# Altium schematic sheet DVD.SchDoc (part 2 of 3)
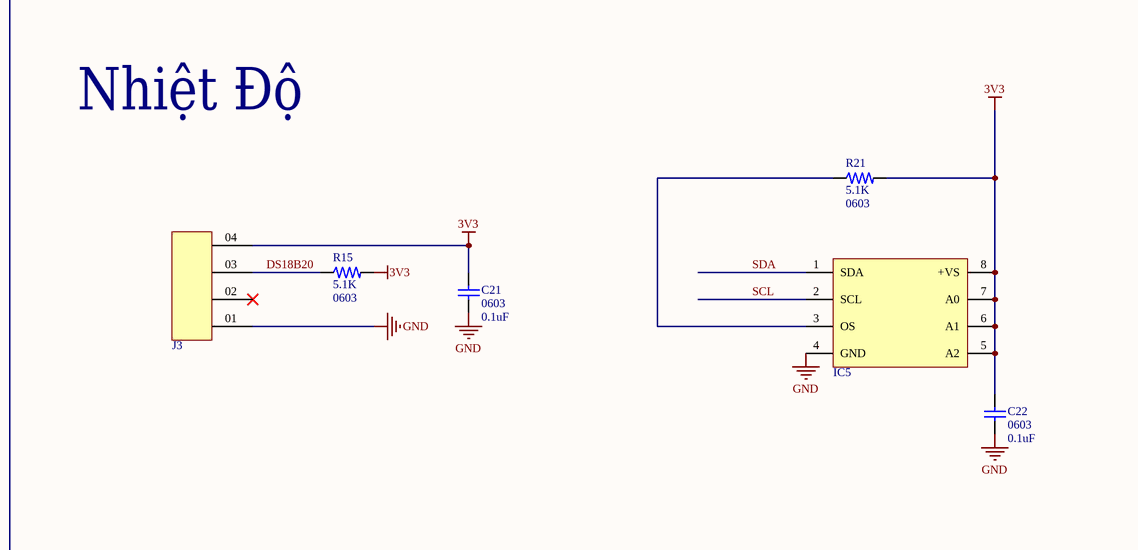
[diagram p6: DVD.SchDoc, bottom right]
## Library data of the parts
C1 = CAP; 22uF; 25V; SMD; CC0603MRX5R6BB226: Multilayer Ceramic Capacitor, 22 uF, 10 V, ï¿½ 20%, X5R, 0603 [1608 Metric]; Manufacturer: Yageo; Designer: TVBac; Supplier: Future Electronics; Supplier Part Number: 9078094; Manufacturer Part Number: CC0603MRX5R6BB226; RoHS: No; Category: Ceramic Capacitors; Stock: 780000; Pricing: 4000=0.122, 8000=0.12, 12000=0.119, 16000=0.118 (USD); Lead Free: 5697LeadFree; Halogen Free: 5694HalogenFree; ComponentLink1URL: http://www.mouser.com/ds/2/447/Yageo_UPY-GP_NP0_16V-to-50V_9-358835.pdf?src-supplier=Mouser; ComponentLink1Description: http://www.mouser.com/ds/2/447/Yageo_UPY-GP_NP0_16V-to-50V_9-358835.pdf?src-supplier=Mouser; ComponentLink2URL: http://www.yageo.com/documents/recent/UPY-GPHC_X5R_4V-to-50V_25.pdf?src-supplier=Digikey; ComponentLink2Description: http://www.yageo.com/documents/recent/UPY-GPHC_X5R_4V-to-50V_25.pdf?src-supplier=Digikey; ComponentLink3URL: https://datasheet.octopart.com/CC0603MRX5R6BB226-Yageo-datasheet-137875056.pdf?src-supplier=Future+Electronics; ComponentLink3Description: https://datasheet.octopart.com/CC0603MRX5R6BB226-Yageo-datasheet-137875056.pdf?src-supplier=Future+Electronics; ComponentLink4URL: https://www.digikey.com/en/products/detail/yageo/CC0603MRX5R6BB226/5195226; ComponentLink4Description: Link Digikey; RoHS Compliant: 5897YesNo
C2 C12 C15 = CAP; 10uF; 25V; SMD; 0603; CC0603MRX5R8BB106: Multilayer Ceramic Capacitor, 10 uF, 25 V, ï¿½ 20%, X5R, 0603 [1608 Metric]; Manufacturer: Yageo; Designer: TVBac; Supplier: Future Electronics; Supplier Part Number: 3086968; Manufacturer Part Number: CC0603MRX5R8BB106; RoHS: Yes; Category: Ceramic Capacitors; Stock: 296000; Pricing: 4000=0.155, 8000=0.153, 12000=0.151 (USD); Mounting Technology: Surface Mount; Case/Package: 0603; Case Code (Imperial): 0603; Case Code (Metric): 1608; Min Operating Temperature: -55°C; Max Operating Temperature: 85°C; Packaging: Cut Tape; Tolerance: 20%; Voltage Rating: 25V; Series: CC; Dielectric: X5R; Voltage Rating (DC): 25V; RoHS Compliant: Yes; Halogen Free: Halogen Free; Lead Free: Lead Free; ComponentLink1URL: https://www.yageo.com/upload/media/product/productsearch/datasheet/mlcc/UPY-GPHC_X5R_4V-to-50V_26.pdf?src-supplier=Digikey; ComponentLink1Description: https://www.yageo.com/upload/media/product/productsearch/datasheet/mlcc/UPY-GPHC_X5R_4V-to-50V_26.pdf?src-supplier=Digikey; ComponentLink2URL: https://datasheet.octopart.com/CC0603MRX5R8BB106-Yageo-datasheet-182965619.pdf?src-supplier=Farnell; ComponentLink2Description: https://datasheet.octopart.com/CC0603MRX5R8BB106-Yageo-datasheet-182965619.pdf?src-supplier=Farnell; ComponentLink3Description: Link Digikey; ComponentLink3URL: https://www.digikey.com/en/products/detail/yageo/CC0603MRX5R8BB106/7164378
C3 = CAP; 1uF; 16V; 0603; SMD; CC0603KRX7R7BB105: 0603 1 uF 16 V ±10 % Tolerance X7R SMT Multilayer Ceramic Capacitor; Manufacturer: Yageo; Material: 4241ConductorMaterial; Dissipation Factor: 5%; Designer: TVBac; Supplier: Digikey; Supplier Part Number: 311-1446-1-ND; Manufacturer Part Number: CC0603KRX7R7BB105; RoHS: Yes; Category: Ceramic Capacitors; Stock: 9165861; Pricing: 1=0.1, 10=0.066, 50=0.0392, 100=0.0308, 500=0.02274, 1000=0.01882, 4000=0.01785, 8000=0.01626, 12000=0.01545, 20000=0.01456, 28000=0.01404, 40000=0.01353, 100000=0.01313 (USD); Dielectric: X7R; Voltage Rating (DC): 16V; Lead Free: 5697LeadFree; Halogen Free: 5694HalogenFree; ComponentLink1URL: https://datasheet.ciiva.com/8033/1734573-8033801.pdf?src-supplier=Element14; ComponentLink1Description: https://datasheet.ciiva.com/8033/1734573-8033801.pdf?src-supplier=Element14; ComponentLink2URL: https://datasheet.ciiva.com/8033/1734573-8033800.pdf?src-supplier=Element14; ComponentLink2Description: https://datasheet.ciiva.com/8033/1734573-8033800.pdf?src-supplier=Element14; ComponentLink3URL: https://datasheet.ciiva.com/7978/1489800-7978143.pdf?src-supplier=Element14; ComponentLink3Description: https://datasheet.ciiva.com/7978/1489800-7978143.pdf?src-supplier=Element14; ComponentLink4URL: https://datasheet.ciiva.com/28450/1489800-28450557.pdf?src-supplier=Element14; ComponentLink4Description: https://datasheet.ciiva.com/28450/1489800-28450557.pdf?src-supplier=Element14; ComponentLink5Description: https://datasheet.ciiva.com/176/mlccorderingcode-176789.pdf?src-supplier=Digikey; ComponentLink5URL: https://datasheet.ciiva.com/176/mlccorderingcode-176789.pdf?src-supplier=Digikey; ComponentLink6Description: https://datasheet.ciiva.com/176/mlccorderingcode-176788.pdf?src-supplier=Digikey; ComponentLink6URL: https://datasheet.ciiva.com/176/mlccorderingcode-176788.pdf?src-supplier=Digikey; ComponentLink7Description: https://datasheet.ciiva.com/176/mlccorderingcode-176790.pdf?src-supplier=Digikey; ComponentLink7URL: https://datasheet.ciiva.com/176/mlccorderingcode-176790.pdf?src-supplier=Digikey; Mounting Technology: Surface Mount; Case/Package: 0603; Pins: 2; Case Code (Metric): 1608; Case Code (Imperial): 0603; Min Operating Temperature: -55°C; Max Operating Temperature: 125°C; Tolerance: 10%; Voltage Rating: 16V; Package Quantity: 1; Packaging: Tape and Reel; Termination: SMD/SMT; Voltage: 16V; Series: CC; Construction: Flat; Length: 1.6mm; Width: 0.031inch; Height: 0.8mm; Thickness: 0.035inch; Depth: 0.8mm; Radiation Hardening: No; RoHS Compliant: Yes; Reach SVHC Compliant: Unknown; ComponentLink8URL: https://datasheet.ciiva.com/5425/upy-gphc-x7r-6-3v-to-50v-8-12304-5425495.pdf?src-supplier=Mouser; ComponentLink8Description: https://datasheet.ciiva.com/5425/upy-gphc-x7r-6-3v-to-50v-8-12304-5425495.pdf?src-supplier=Mouser; ComponentLink9Description: Link Digikey; ComponentLink9URL: https://www.digikey.com/en/products/detail/yageo/CC0603KRX7R7BB105/2833611?s=N4IgTCBcDaIMJwAwDZEGYDSAlAGgdizwCEiBGRAVhAF0BfIA
C4 C13 = CAP; 1uF; 10V; 0603; SMD; CC0603ZRY5V6BB105: Surface Mount Ceramic Multilayer Capacitor 1uF -20% to 80% Y5V 10V 0603 Paper T/R; Manufacturer: Yageo; Dielectric Material: 4241ConductorMaterial; Designer: TVBac; Supplier: Digikey; Supplier Part Number: 311-1357-1-ND; Manufacturer Part Number: CC0603ZRY5V6BB105; RoHS: Yes; Category: Ceramic Capacitors; Stock: 2070294; Pricing: 1=0.1, 10=0.041, 50=0.0234, 100=0.0182, 500=0.01366, 1000=0.01074 (USD); Voltage Rating (AC): 10V; Lead Free: 5697LeadFree; Halogen Free: 5694HalogenFree; ComponentLink1URL: https://datasheet.ciiva.com/23768/97931-23768032.pdf?src-supplier=Newark; ComponentLink1Description: https://datasheet.ciiva.com/23768/97931-23768032.pdf?src-supplier=Newark; ComponentLink2URL: https://datasheet.ciiva.com/144/mlccorderingcode-144397.pdf?src-supplier=Digikey; ComponentLink2Description: https://datasheet.ciiva.com/144/mlccorderingcode-144397.pdf?src-supplier=Digikey; ComponentLink3URL: https://datasheet.ciiva.com/144/mlccorderingcode-144398.pdf?src-supplier=Digikey; ComponentLink3Description: https://datasheet.ciiva.com/144/mlccorderingcode-144398.pdf?src-supplier=Digikey; ComponentLink4URL: https://datasheet.ciiva.com/144/mlccorderingcode-144399.pdf?src-supplier=Digikey; ComponentLink4Description: https://datasheet.ciiva.com/144/mlccorderingcode-144399.pdf?src-supplier=Digikey; ComponentLink5URL: https://datasheet.ciiva.com/5425/upy-gphc-y5v-6-3v-to-50v-5-5425434.pdf?src-supplier=Mouser; ComponentLink5Description: https://datasheet.ciiva.com/5425/upy-gphc-y5v-6-3v-to-50v-5-5425434.pdf?src-supplier=Mouser; ComponentLink6URL: https://datasheet.ciiva.com/7978/1132289-7978185.pdf?src-supplier=Element14; ComponentLink6Description: https://datasheet.ciiva.com/7978/1132289-7978185.pdf?src-supplier=Element14; ComponentLink7URL: https://datasheet.ciiva.com/8033/1132289-8033926.pdf?src-supplier=Element14; ComponentLink7Description: https://datasheet.ciiva.com/8033/1132289-8033926.pdf?src-supplier=Element14; ComponentLink8URL: https://datasheet.ciiva.com/8033/1132289-8033928.pdf?src-supplier=Element14; ComponentLink8Description: https://datasheet.ciiva.com/8033/1132289-8033928.pdf?src-supplier=Element14; ComponentLink9Description: Link Digikey; ComponentLink9URL: https://www.digikey.com/en/products/detail/yageo/CC0603ZRY5V6BB105/2103095
C5 C6 C14 C20-C23 = CAP; 0.1uF; 16V; 0603; SMD; CC0603KRX7R7BB104: 0603 0.1 uF 16 V ±10 % Tolerance X7R SMT Multilayer Ceramic Capacitor; Manufacturer: Yageo; Insulation Resistance: 100GR; Designer: TVBac; Supplier: Digikey; Supplier Part Number: 311-1088-1-ND; Manufacturer Part Number: CC0603KRX7R7BB104; RoHS: Yes; Category: Ceramic Capacitors; Stock: 8705780; Pricing: 1=0.1, 10=0.042, 50=0.0238, 100=0.0185, 500=0.01392, 1000=0.01094, 4000=0.00915, 8000=0.00836, 12000=0.00796, 28000=0.00756, 100000=0.00547, 200000=0.00529, 400000=0.00497 (USD); Mounting Technology: Surface Mount; Case/Package: 0603; Pins: 2; Case Code (Metric): 1608; Case Code (Imperial): 0603; Material: Ceramic; Min Operating Temperature: -55°C; Max Operating Temperature: 125°C; Voltage Rating: 16V; Tolerance: 10%; Voltage Rating (DC): 16V; Package Quantity: 1; Packaging: Tape and Reel; Dielectric: X7R; Termination: SMD/SMT; Voltage: 16V; Series: CC; Length: 1.6mm; Width: 0.031inch; Height: 0.8mm; Thickness: 0.035inch; Depth: 0.8mm; Radiation Hardening: No; Reach SVHC Compliant: No; Lead Free: Lead Free; Halogen Free: Halogen Free; RoHS Compliant: Yes; ComponentLink1URL: https://datasheet.ciiva.com/11786/0900766b80d84f1d-11786077.pdf?src-supplier=Rs; ComponentLink1Description: https://datasheet.ciiva.com/11786/0900766b80d84f1d-11786077.pdf?src-supplier=Rs; ComponentLink2URL: https://datasheet.ciiva.com/8033/70765-8033799.pdf?src-supplier=Element14; ComponentLink2Description: https://datasheet.ciiva.com/8033/70765-8033799.pdf?src-supplier=Element14; ComponentLink3URL: https://datasheet.ciiva.com/7978/1489800-7978141.pdf?src-supplier=Element14; ComponentLink3Description: https://datasheet.ciiva.com/7978/1489800-7978141.pdf?src-supplier=Element14; ComponentLink4URL: https://datasheet.ciiva.com/28450/1489800-28450552.pdf?src-supplier=Element14; ComponentLink4Description: https://datasheet.ciiva.com/28450/1489800-28450552.pdf?src-supplier=Element14; ComponentLink5URL: https://datasheet.ciiva.com/46430/1734573-46430156.pdf?src-supplier=Element14; ComponentLink5Description: https://datasheet.ciiva.com/46430/1734573-46430156.pdf?src-supplier=Element14; ComponentLink6URL: https://datasheet.ciiva.com/144/mlccorderingcode-144183.pdf?src-supplier=Digikey; ComponentLink6Description: https://datasheet.ciiva.com/144/mlccorderingcode-144183.pdf?src-supplier=Digikey; ComponentLink7URL: https://datasheet.ciiva.com/144/mlccorderingcode-144182.pdf?src-supplier=Digikey; ComponentLink7Description: https://datasheet.ciiva.com/144/mlccorderingcode-144182.pdf?src-supplier=Digikey; ComponentLink8URL: https://datasheet.ciiva.com/144/mlccorderingcode-144184.pdf?src-supplier=Digikey; ComponentLink8Description: https://datasheet.ciiva.com/144/mlccorderingcode-144184.pdf?src-supplier=Digikey; ComponentLink9URL: https://datasheet.ciiva.com/8033/1734573-8033797.pdf?src-supplier=Element14; ComponentLink9Description: https://datasheet.ciiva.com/8033/1734573-8033797.pdf?src-supplier=Element14; ComponentLink10URL: https://datasheet.ciiva.com/13395/upy-gphc-x7r-6-3v-to-50v-8-13395674.pdf?src-supplier=Mouser; ComponentLink10Description: https://datasheet.ciiva.com/13395/upy-gphc-x7r-6-3v-to-50v-8-13395674.pdf?src-supplier=Mouser; ComponentLink11URL: https://datasheet.ciiva.com/11464/upy-gphc-x7r-6-3v-to-50v-8-11464735.pdf?src-supplier=Avnet; ComponentLink11Description: https://datasheet.ciiva.com/11464/upy-gphc-x7r-6-3v-to-50v-8-11464735.pdf?src-supplier=Avnet; ComponentLink12URL: https://datasheet.ciiva.com/15165/getdatasheetpartid-63554-15165387.pdf?src-supplier=Verical; ComponentLink12Description: https://datasheet.ciiva.com/15165/getdatasheetpartid-63554-15165387.pdf?src-supplier=Verical; ComponentLink13Description: Link Digikey; ComponentLink13URL: https://www.digikey.com/en/products/detail/yageo/CC0603KRX7R7BB104/302822
C7 C8 C17 = CAP; 0.1uF; 100V; 0603; SMD; CC0603KRX7R0BB104: Multilayer Ceramic Capacitors MLCC - SMD/SMT 100V 0.1uF X7R 0603 10%; Manufacturer: Yageo; Material: 4241ConductorMaterial; Designer: TVBac; Supplier: Digikey; Supplier Part Number: 311-1523-1-ND; Manufacturer Part Number: CC0603KRX7R0BB104; RoHS: Yes; Category: Ceramic Capacitors; Stock: 5373598; Pricing: 1=0.17, 10=0.113, 50=0.0676, 100=0.0531, 500=0.03922, 1000=0.03246, 4000=0.02764, 8000=0.02572, 12000=0.02443, 28000=0.02314, 100000=0.01752, 200000=0.0171, 400000=0.01607 (USD); Mounting Technology: Surface Mount; Case/Package: 0603; Case Code (Metric): 1608; Case Code (Imperial): 0603; Weight: 7.1E-05oz; Min Operating Temperature: -55°C; Max Operating Temperature: 125°C; Package Quantity: 4000; Voltage Rating: 100V; Tolerance: 10%; Packaging: Tape and Reel; Dielectric: X7R; Termination: SMD/SMT; Voltage Rating (DC): 100V; Series: CC; Length: 0.063inch; Width: 0.031inch; Height: 900um; Thickness: 0.035inch; RoHS Compliant: Yes; Lead Free: 5697LeadFree; ComponentLink1URL: https://datasheet.ciiva.com/6277/mlccorderingcode-6277082.pdf?src-supplier=Digikey; ComponentLink1Description: https://datasheet.ciiva.com/6277/mlccorderingcode-6277082.pdf?src-supplier=Digikey; ComponentLink2URL: https://datasheet.ciiva.com/6277/mlccorderingcode-6277081.pdf?src-supplier=Digikey; ComponentLink2Description: https://datasheet.ciiva.com/6277/mlccorderingcode-6277081.pdf?src-supplier=Digikey; ComponentLink3URL: https://datasheet.ciiva.com/6277/mlccorderingcode-6277030.pdf?src-supplier=Digikey; ComponentLink3Description: https://datasheet.ciiva.com/6277/mlccorderingcode-6277030.pdf?src-supplier=Digikey; ComponentLink4Description: Link Digikey; ComponentLink4URL: https://www.digikey.com/en/products/detail/yageo/CC0603KRX7R0BB104/3476111?s=N4IgTCBcDaIMwEYEFoEFYx1cgcgERAF0BfIA
C9 = CAP; 1uF; 100V; 1206; C1206C105K1RACTU: Multilayer Ceramic Capacitor, 1 uF, 100 V, ± 10%, X7R, 1206 [3216 Metric]; Manufacturer: KEMET; Material: 4241ConductorMaterial; Dissipation Factor: 2.5%; Designer: TVBac; Supplier: Mouser; Supplier Part Number: 80-C1206C105K1R; Manufacturer Part Number: C1206C105K1RACTU; RoHS: Yes; Category: Ceramic Capacitors; Stock: 49348; Pricing: 1=0.49, 10=0.24, 50=0.24, 100=0.155, 1000=0.148, 10000=0.117 (USD); Mounting Technology: Surface Mount; Case/Package: 1206; Case Code (Metric): 3216; Case Code (Imperial): 1206; Weight: 0.000571oz; Dielectric Material: Ceramic; Min Operating Temperature: -55°C; Max Operating Temperature: 125°C; Packaging: Cut Tape; Voltage Rating: 100V; Dielectric: X7R; Voltage: 100V; Termination: SMD/SMT; Tolerance: 10%; Voltage Rating (DC): 100V; Package Quantity: 2000; Series: C; Length: 3.2mm; Width: 0.063inch; Height: 1.6mm; Thickness: 0.071inch; Depth: 1.6mm; Reach SVHC Compliant: No; RoHS Compliant: Yes; ComponentLink1URL: http://www.farnell.com/datasheets/2741188.pdf?src-supplier=Farnell; ComponentLink1Description: http://www.farnell.com/datasheets/2741188.pdf?src-supplier=Farnell; ComponentLink2URL: http://www.mouser.com/ds/2/212/KEM_C1002_X7R_SMD-357932.pdf?src-supplier=Mouser; ComponentLink2Description: http://www.mouser.com/ds/2/212/KEM_C1002_X7R_SMD-357932.pdf?src-supplier=Mouser; ComponentLink3URL: http://www.alliedelec.com/m/d/51f554c3dd800f51434b811e71a34895.pdf?src-supplier=Allied+Electronics; ComponentLink3Description: http://www.alliedelec.com/m/d/51f554c3dd800f51434b811e71a34895.pdf?src-supplier=Allied+Electronics; ComponentLink4URL: https://datasheet.octopart.com/C1206C105K1RACTU-KEMET-datasheet-74831901.pdf?src-supplier=Newark; ComponentLink4Description: https://datasheet.octopart.com/C1206C105K1RACTU-KEMET-datasheet-74831901.pdf?src-supplier=Newark; ComponentLink5URL: http://datasheet.octopart.com/C1206C105K1RACTU-Kemet-datasheet-46909923.pdf?src-supplier=Onlinecomponents.com; ComponentLink5Description: http://datasheet.octopart.com/C1206C105K1RACTU-Kemet-datasheet-46909923.pdf?src-supplier=Onlinecomponents.com; ComponentLink6URL: http://datasheet.octopart.com/C1206C105K1RACTU-Kemet-datasheet-46909923.pdf?src-supplier=Avnet; ComponentLink6Description: http://datasheet.octopart.com/C1206C105K1RACTU-Kemet-datasheet-46909923.pdf?src-supplier=Avnet; ComponentLink7URL: http://www.farnell.com/datasheets/2741188.pdf?src-supplier=Newark; ComponentLink7Description: http://www.farnell.com/datasheets/2741188.pdf?src-supplier=Newark; ComponentLink8URL: http://datasheet.octopart.com/C1206C105K1RACTU-Kemet-datasheet-46909923.pdf?src-supplier=Digikey; ComponentLink8Description: http://datasheet.octopart.com/C1206C105K1RACTU-Kemet-datasheet-46909923.pdf?src-supplier=Digikey; ComponentLink9URL: http://www.kemet.com/docfinder?Partnumber=C1206C105K1RACTU&src-supplier=Digikey; ComponentLink9Description: http://www.kemet.com/docfinder?Partnumber=C1206C105K1RACTU&src-supplier=Digikey; ComponentLink10URL: https://api.kemet.com/component-edge/download/datasheet/C1206C105K1RACTU.pdf?src-supplier=Digikey; ComponentLink10Description: https://api.kemet.com/component-edge/download/datasheet/C1206C105K1RACTU.pdf?src-supplier=Digikey; ComponentLink11URL: http://datasheet.octopart.com/C1206C105K1RACTU-Kemet-datasheet-46909923.pdf?src-supplier=Distrelec; ComponentLink11Description: http://datasheet.octopart.com/C1206C105K1RACTU-Kemet-datasheet-46909923.pdf?src-supplier=Distrelec; ComponentLink12URL: https://datasheet.octopart.com/C1206C105K1RACTU-Kemet-datasheet-46909923.pdf?src-supplier=Element14; ComponentLink12Description: https://datasheet.octopart.com/C1206C105K1RACTU-Kemet-datasheet-46909923.pdf?src-supplier=Element14; ComponentLink13URL: https://datasheet.octopart.com/C1206C105K1RACTU-KEMET-datasheet-145014209.pdf?src-supplier=Farnell; ComponentLink13Description: https://datasheet.octopart.com/C1206C105K1RACTU-KEMET-datasheet-145014209.pdf?src-supplier=Farnell; ComponentLink14URL: http://www.farnell.com/datasheets/2741188.pdf?src-supplier=Element14; ComponentLink14Description: http://www.farnell.com/datasheets/2741188.pdf?src-supplier=Element14; ComponentLink15URL: http://datasheet.octopart.com/C1206C105K1RACTU-Kemet-datasheet-46909923.pdf?src-supplier=NAC+Semi; ComponentLink15Description: http://datasheet.octopart.com/C1206C105K1RACTU-Kemet-datasheet-46909923.pdf?src-supplier=NAC+Semi; ComponentLink16URL: https://datasheet.octopart.com/C1206C105K1RACTU-KEMET-datasheet-158241793.pdf?src-supplier=TME; ComponentLink16Description: https://datasheet.octopart.com/C1206C105K1RACTU-KEMET-datasheet-158241793.pdf?src-supplier=TME; ComponentLink17URL: http://datasheet.octopart.com/C1206C105K1RACTU-Kemet-datasheet-46909923.pdf?src-supplier=Electro+Sonic; ComponentLink17Description: http://datasheet.octopart.com/C1206C105K1RACTU-Kemet-datasheet-46909923.pdf?src-supplier=Electro+Sonic; ComponentLink18Description: Link Digikey; ComponentLink18URL: https://www.digikey.com/en/products/detail/kemet/C1206C105K1RAC7800/5119820
C11 = CAP; 100uF; 25V; SMD; EEH-ZA1E101XP: Cap Aluminum 100uF 25V 20% (6.3 X 7.7mm) SMD 0.03 Ohm 2000mA 5000h 105 C Embossed T/R; Manufacturer: Panasonic; ESR (Equivalent Series Resistance): 30mR; Ripple Current: 2A; Life (Hours): 5000Hour; Leakage Current: 25uA; Dissipation Factor: 14%; Lead Diameter: 0.65mm; Designer: TVBac; Supplier: Digikey; Supplier Part Number: P15436CT-ND; Manufacturer Part Number: EEH-ZA1E101XP; RoHS: Yes; Category: Polymer Capacitors; Stock: 16312; Pricing: 1=1.59, 10=1.006, 50=0.7694, 100=0.6957 (USD); Mounting Technology: Surface Mount,PCB; Case/Package: Radial; Pins: 8; Material: Polymer; Min Operating Temperature: -55°C; Max Operating Temperature: 105°C; Ripple Current (AC): 2A; Packaging: Tape and Reel; Tolerance: 20%; Voltage Rating: 25V; Voltage Rating (DC): 25V; Package Quantity: 900; Termination: SMD/SMT; Voltage: 25V; Series: ZA; Construction: Cylindrical; Technology: HYBRID; Diameter: 6.3mm; Length: 7.7mm; Height: 7.7mm; Lead Pitch: 1.8mm; Ratings: AEC-Q200; Radiation Hardening: No; Reach SVHC Compliant: No; Lead Free: Lead Free; RoHS Compliant: Yes; ComponentLink1URL: https://datasheet.ciiva.com/14818/86aba0000ce136-14818650.pdf?src-supplier=Arrow+Electronics; ComponentLink1Description: https://datasheet.ciiva.com/14818/86aba0000ce136-14818650.pdf?src-supplier=Arrow+Electronics; ComponentLink2URL: https://datasheet.ciiva.com/25614/0900766b81233638-25614238.pdf?src-supplier=Rs; ComponentLink2Description: https://datasheet.ciiva.com/25614/0900766b81233638-25614238.pdf?src-supplier=Rs; ComponentLink3URL: https://datasheet.ciiva.com/6303/aba0000ce136-6303802.pdf?src-supplier=Digikey; ComponentLink3Description: https://datasheet.ciiva.com/6303/aba0000ce136-6303802.pdf?src-supplier=Digikey; ComponentLink4URL: https://datasheet.ciiva.com/6303/aba0000ce136-6303804.pdf?src-supplier=Digikey; ComponentLink4Description: https://datasheet.ciiva.com/6303/aba0000ce136-6303804.pdf?src-supplier=Digikey; ComponentLink5URL: https://datasheet.ciiva.com/6303/aba0000ce136-6303805.pdf?src-supplier=Digikey; ComponentLink5Description: https://datasheet.ciiva.com/6303/aba0000ce136-6303805.pdf?src-supplier=Digikey; ComponentLink6URL: https://datasheet.ciiva.com/6134/1536543-6134360.pdf?src-supplier=Farnell; ComponentLink6Description: https://datasheet.ciiva.com/6134/1536543-6134360.pdf?src-supplier=Farnell; ComponentLink7URL: https://datasheet.ciiva.com/32372/86aba0000ce136-32372459.pdf?src-supplier=Onlinecomponents.com; ComponentLink7Description: https://datasheet.ciiva.com/32372/86aba0000ce136-32372459.pdf?src-supplier=Onlinecomponents.com; ComponentLink8URL: https://datasheet.ciiva.com/14604/70314667-14604008.pdf?src-supplier=Allied+Electronics; ComponentLink8Description: https://datasheet.ciiva.com/14604/70314667-14604008.pdf?src-supplier=Allied+Electronics; ComponentLink9URL: https://datasheet.ciiva.com/48540/eehza-eng-tds-48540972.pdf?src-supplier=Distrelec; ComponentLink9Description: https://datasheet.ciiva.com/48540/eehza-eng-tds-48540972.pdf?src-supplier=Distrelec; ComponentLink10URL: https://datasheet.ciiva.com/7902/1536543-7902997.pdf?src-supplier=Element14; ComponentLink10Description: https://datasheet.ciiva.com/7902/1536543-7902997.pdf?src-supplier=Element14; ComponentLink11Description: Link Digikey; ComponentLink11URL: https://www.digikey.com/en/products/detail/panasonic-electronic-components/EEH-ZA1E101XP/3088115
C16 = CAP; 2.2uF; 25V; SMD; 0603; CC0603KRX5R8BB225: 0603 2.2 uF 25 V ±10% Tolerance X5R SMT Multilayer Ceramic Capacitor; Manufacturer: Yageo; Material: 4241ConductorMaterial; Designer: TVBac; Supplier: Future Electronics; Supplier Part Number: 2077058; Manufacturer Part Number: CC0603KRX5R8BB225; RoHS: Yes; Category: Ceramic Capacitors; Stock: 108000; Pricing: 4000=0.0441, 8000=0.0434, 12000=0.0429, 16000=0.0426, 20000=0.0417 (USD); Height: 900um; Halogen Free: 5694HalogenFree; Lead Free: 5697LeadFree; ComponentLink1URL: https://datasheet.ciiva.com/26936/getdatasheetpartid-782757-26936061.pdf?src-supplier=Verical; ComponentLink1Description: https://datasheet.ciiva.com/26936/getdatasheetpartid-782757-26936061.pdf?src-supplier=Verical
C19 = CAP; 0.1uF; 10V; 0603; SMD; CC0603KRX7R6BB104: Multilayer Ceramic Capacitor, 0.1 uF, 10 V, ± 10%, X7R, 0603 [1608 Metric]; Manufacturer: Yageo; Material: 4241ConductorMaterial; Designer: TVBac; Supplier: Digikey; Supplier Part Number: 311-4055-1-ND; Manufacturer Part Number: CC0603KRX7R6BB104; RoHS: Yes; Category: Ceramic Capacitors; Stock: 113177; Pricing: 1=0.1, 10=0.067, 50=0.0398, 100=0.0314, 500=0.02316, 1000=0.01918, 4000=0.01633, 8000=0.01519, 12000=0.01443, 28000=0.01367, 100000=0.01035, 200000=0.0101, 400000=0.00949 (USD); Lead Free: 5697LeadFree; Halogen Free: 5694HalogenFree; ComponentLink1URL: https://datasheet.ciiva.com/11586/upy-gphc-x7r-6-3v-to-50v-8-11586327.pdf?src-supplier=Avnet; ComponentLink1Description: https://datasheet.ciiva.com/11586/upy-gphc-x7r-6-3v-to-50v-8-11586327.pdf?src-supplier=Avnet; ComponentLink2Description: Link Digikey; ComponentLink2URL: https://www.digikey.com/en/products/detail/yageo/CC0603KRX7R6BB104/5883741
D1-D3 = DIODE; SMD; SCHOTTKY; SS34-HF: Diode Schottky Si 40V 3A 2-Pin SMA T/R; Manufacturer: Comchip; Designer: TVBac; Supplier: Digikey; Supplier Part Number: 641-2115-1-ND; Manufacturer Part Number: SS34-HF; RoHS: Yes; Category: LDO; Stock: 65957; Pricing: 1=0.46, 10=0.325, 100=0.164, 500=0.14536, 1000=0.11312, 2000=0.10124 (USD); RoHS Compliant: Yes; ComponentLink1URL: http://www.comchiptech.com/admin/files/product/20190514101641.pdf?src-supplier=Digikey; ComponentLink1Description: http://www.comchiptech.com/admin/files/product/20190514101641.pdf?src-supplier=Digikey; ComponentLink2Description: Link Digikey; ComponentLink2URL: https://www.digikey.com/en/products/detail/comchip-technology/SS34-HF/10279693
D4 = L0603_RED: 20mA 330mcd Colorless Transparent Lens -20℃~+85℃ Positive Stick 620nm~630nm Red 120° 50mW 2.3V 0603 LED Indication - Discrete ROHS; Manufacturer: XINGLIGHT; Manufacture Part Number: XL-1608SURC-06; Packaging: Cut Tape (CT); Link: https://www.lcsc.com/product-detail/LED-Indication-Discrete_XINGLIGHT-XL-1608SURC-06_C965799.html?s_z=n_LED%200603%20red; Package: 0603
D5 = L0603_GREEN: 225mcd~450mcd Colorless Transparent Lens -40℃~+85℃ Positive Stick 520nm~535nm Green 120° 70mW 2.4V~3V 0603 LED Indication - Discrete ROHS; Manufacturer: Amicc; Manufacture Part Number: A-SP192DGHC-C01-4T; Packaging: Cut Tape (CT); Link: https://www.lcsc.com/product-detail/LED-Indication-Discrete_Amicc-A-SP192DGHC-C01-4T_C19171301.html?s_z=n_LED%200603%20green; Package: 0603
IC1 = SX1308: Boost type Adjustable 28V 2A 2V~24V SOT-23-6 DC-DC Converters ROHS; Manufacturer: SX(Shenzhen Suosemi Tech); Manufacture Part Number: SX1308; Packaging: Cut Tape; Link: https://www.lcsc.com/product-detail/DC-DC-Converters_SX-Shenzhen-Suosemi-Tech-SX1308_C78162.html?s_z=n_sx1308; Package: SOT-23-6; LCSC Part: C78162
IC3 = INA219AIDR: 26-V 12-bit I2C output digital power monitor 8-SOIC -40 to 125; Manufacturer: Texas Instruments; Manufacturer Lifecycle Status: ACTIVE; Accuracy: 1%; Common Mode Rejection Ratio: 100dB; Input Offset Voltage (Vos): 10µV; Max Supply Voltage: 5.5V; Min Supply Voltage: 3V; Number of Amplifiers: 1; Operating Supply Current: 1mA; Quiescent Current: 700µA; Supplier: Arrow Electronics; Supplier Part Number: INA219AIDR; Manufacturer Part Number: INA219AIDR; RoHS: Compliant; Category: Amplifiers - Op Amps, Buffer, Instrumentation; Stock: 155; Pricing: 1=1.242, 10=1.066, 25=1.013, 100=0.964 (USD); Case/Package: SOIC; Contact Plating: Gold; Height: 1.75mm; Lead Free: Lead Free; Length: 4.9mm; Lifecycle Status: Production; Max Operating Temperature: 125°C; Min Operating Temperature: -40°C; Pins: 8; Output Current: 10mA; Packaging: Digi-Reel®; Radiation Hardening: No; REACH SVHC: No; Schedule B: 8542330000, 8542390000, 8542390000|8542390000|8542390000|8542390000|8542390000; Thickness: 1.58mm; Weight: 72.603129mg; Width: 3.91mm; ComponentLink1URL: https://octopart.com:443/opatz8j6/c1?t=LPR-GkmZO_ZD-NX-ahZdJ4sYICydW44c2UBlUET0hfIsA9Nrjdm8Gx3RZAOP8kdTDH2OjP-SE1TaerxklCx1ZDwRxyehOK9pFkv4PMLI3mW5xMMD8VZ2ES56dMdffvNV-x_EoqMRXU6TLYibM_bKndj1c0JD9XI870WZP0BYQBZNl4xAK99483E3Pcq9CbioArzH5a-oTKjVwwtdto_Yzyuah98mqRg4i18Hqo2FpL5dMbriRMK6ja3tSbL2EQrRvrdOdWX3W4gBXxVTp6DZuYdoMynXlFnVbLKeaM1T6nxR0MXLp7djVRhG4wsRxI-nwoVtlvjBFzcqh97UvjlekN8sVTVDVyyb7EXZQbJ_btva5EUHN3w45iA9qowRXxSAvx_IqA&src-supplier=Texas+Instruments; ComponentLink1Description: https://octopart.com:443/opatz8j6/c1?t=LPR-GkmZO_ZD-NX-ahZdJ4sYICydW44c2UBlUET0hfIsA9Nrjdm8Gx3RZAOP8kdTDH2OjP-SE1TaerxklCx1ZDwRxyehOK9pFkv4PMLI3mW5xMMD8VZ2ES56dMdffvNV-x_EoqMRXU6TLYibM_bKndj1c0JD9XI870WZP0BYQBZNl4xAK99483E3Pcq9CbioArzH5a-oTKjVwwtdto_Yzyuah98mqRg4i18Hqo2FpL5dMbriRMK6ja3tSbL2EQrRvrdOdWX3W4gBXxVTp6DZuYdoMynXlFnVbLKeaM1T6nxR0MXLp7djVRhG4wsRxI-nwoVtlvjBFzcqh97UvjlekN8sVTVDVyyb7EXZQbJ_btva5EUHN3w45iA9qowRXxSAvx_IqA&src-supplier=Texas+Instruments; ComponentLink2URL: https://datasheet.octopart.com:443/INA219AIDR-Texas-Instruments-datasheet-10383171.pdf?src-supplier=Texas+Instruments; ComponentLink2Description: https://datasheet.octopart.com:443/INA219AIDR-Texas-Instruments-datasheet-10383171.pdf?src-supplier=Texas+Instruments; ComponentLink3URL: https://datasheet.octopart.com:443/INA219AIDR-Texas-Instruments-datasheet-10258484.pdf?src-supplier=Texas+Instruments; ComponentLink3Description: https://datasheet.octopart.com:443/INA219AIDR-Texas-Instruments-datasheet-10258484.pdf?src-supplier=Texas+Instruments; ComponentLink4URL: https://sigma.octopart.com:443/49249642/technical_drawing/Texas-Instruments-INA219AIDR.pdf?src-supplier=Texas+Instruments; ComponentLink4Description: https://sigma.octopart.com:443/49249642/technical_drawing/Texas-Instruments-INA219AIDR.pdf?src-supplier=Texas+Instruments; ComponentLink5URL: https://datasheet.octopart.com:443/INA219AIDR-Texas-Instruments-datasheet-102489495.pdf?src-supplier=Upverter; ComponentLink5Description: https://datasheet.octopart.com:443/INA219AIDR-Texas-Instruments-datasheet-102489495.pdf?src-supplier=Upverter; ComponentLink6URL: https://datasheet.octopart.com:443/INA219AIDR-Texas-Instruments-datasheet-24897021.pdf?src-supplier=Upverter; ComponentLink6Description: https://datasheet.octopart.com:443/INA219AIDR-Texas-Instruments-datasheet-24897021.pdf?src-supplier=Upverter; ComponentLink7URL: https://datasheet.octopart.com:443/INA219AIDR-Texas-Instruments-datasheet-11538655.pdf?src-supplier=element14+APAC; ComponentLink7Description: https://datasheet.octopart.com:443/INA219AIDR-Texas-Instruments-datasheet-11538655.pdf?src-supplier=element14+APAC; ComponentLink8URL: https://datasheet.octopart.com:443/INA219AIDR-Texas-Instruments-datasheet-62088703.pdf?src-supplier=element14+APAC; ComponentLink8Description: https://datasheet.octopart.com:443/INA219AIDR-Texas-Instruments-datasheet-62088703.pdf?src-supplier=element14+APAC; ComponentLink9URL: https://datasheet.octopart.com:443/INA219AIDR-Texas-Instruments-datasheet-62277359.pdf?src-supplier=element14+APAC; ComponentLink9Description: https://datasheet.octopart.com:443/INA219AIDR-Texas-Instruments-datasheet-62277359.pdf?src-supplier=element14+APAC; ComponentLink10URL: https://datasheet.octopart.com:443/INA219AIDR-Texas-Instruments-datasheet-164414650.pdf?src-supplier=SHENGYU+ELECTRONICS; ComponentLink10Description: https://datasheet.octopart.com:443/INA219AIDR-Texas-Instruments-datasheet-164414650.pdf?src-supplier=SHENGYU+ELECTRONICS; ComponentLink11URL: https://datasheet.octopart.com:443/INA219AIDR-Texas-Instruments-datasheet-159115060.pdf?src-supplier=LCSC; ComponentLink11Description: https://datasheet.octopart.com:443/INA219AIDR-Texas-Instruments-datasheet-159115060.pdf?src-supplier=LCSC; ComponentLink12URL: https://datasheet.octopart.com:443/INA219AIDR-Texas-Instruments-datasheet-140571431.pdf?src-supplier=Arrow.cn; ComponentLink12Description: https://datasheet.octopart.com:443/INA219AIDR-Texas-Instruments-datasheet-140571431.pdf?src-supplier=Arrow.cn; ComponentLink13URL: https://datasheet.octopart.com:443/INA219AIDR-Texas-Instruments-datasheet-14155040.pdf?src-supplier=iiiC; ComponentLink13Description: https://datasheet.octopart.com:443/INA219AIDR-Texas-Instruments-datasheet-14155040.pdf?src-supplier=iiiC; ComponentLink14URL: http://sigma.octopart.com:80/conflict_mineral_statement/Texas-Instruments-company-63.pdf?src-supplier=Compliance+Statements; ComponentLink14Description: http://sigma.octopart.com:80/conflict_mineral_statement/Texas-Instruments-company-63.pdf?src-supplier=Compliance+Statements; ComponentLink15URL: http://sigma.octopart.com:80/reach_statement/Texas-Instruments-company-64.pdf?src-supplier=Compliance+Statements; ComponentLink15Description: http://sigma.octopart.com:80/reach_statement/Texas-Instruments-company-64.pdf?src-supplier=Compliance+Statements
IC5 = LM75BIM-5+: Serial Switch/Digital Sensor, 9 Bit(s), 3Cel, CMOS, Rectangular, 8 Pin, Surface Mount; Manufacturer: Analog Devices; Manufacturer Lifecycle Status: PRODUCTION; Interface: 2-Wire, I2C, SMBus, Serial; Max Power Dissipation: 362mW; Max Supply Voltage (DC): 5.5V; Min Supply Voltage (DC): 3V; Operating Supply Current: 250µA; Output Type: Digital, I2C; Resolution: 1.125B; Supplier: DigiKey; Supplier Part Number: LM75BIM-5+-ND; Manufacturer Part Number: LM75BIM-5+; RoHS: Compliant; Category: Analog to Digital Converters (ADCs); Stock: 277; Pricing: 1=2.67, 5=2.382, 10=2.274, 25=2.1452, 50=2.057, 100=1.9762, 500=1.81372, 1000=1.75322, 5000=1.63137 (USD); Case/Package: SOIC; Lifecycle Status: Production; Max Operating Temperature: 125°C; Min Operating Temperature: -55°C; Mounting Technology: Surface Mount; Pins: 8; Operating Supply Voltage: 5.5V; Radiation Hardening: No; ComponentLink1URL: https://octopart.com:443/opatz8j6/c1?t=YplwzHpL-JJLZ_2PRGZZpt756W2xclSjhqXVdEI1uhJ8_WWjbW7-qgeHxwwe1SMULagSLc6USHzl8XuhBHjwSqYk79nBn7LCkVwL1rbbeliDkJ86ulnC6U38m-iQo5pASL4W__81O9e-gp7BJ4jJNYdroiH1YY2DGBMiO5DTDljEwD1jx41NO8_GGUihyPQS3uA_NDDyM9lvT6sjnkswLspbyI9HgaQ2_Ebdp7nvrIldeSGWyNMVZ3D6ks0QZS_VIIbeN8gOxfe-OAINvbqiAbKFlkIsyC7EpES6idiquEIaQjTaF9N-&src-supplier=Analog+Devices; ComponentLink1Description: https://octopart.com:443/opatz8j6/c1?t=YplwzHpL-JJLZ_2PRGZZpt756W2xclSjhqXVdEI1uhJ8_WWjbW7-qgeHxwwe1SMULagSLc6USHzl8XuhBHjwSqYk79nBn7LCkVwL1rbbeliDkJ86ulnC6U38m-iQo5pASL4W__81O9e-gp7BJ4jJNYdroiH1YY2DGBMiO5DTDljEwD1jx41NO8_GGUihyPQS3uA_NDDyM9lvT6sjnkswLspbyI9HgaQ2_Ebdp7nvrIldeSGWyNMVZ3D6ks0QZS_VIIbeN8gOxfe-OAINvbqiAbKFlkIsyC7EpES6idiquEIaQjTaF9N-&src-supplier=Analog+Devices; ComponentLink2URL: https://datasheet.octopart.com:443/LM75BIM-5%2B-Analog-Devices-datasheet-13733767.pdf?src-supplier=Ciiva; ComponentLink2Description: https://datasheet.octopart.com:443/LM75BIM-5%2B-Analog-Devices-datasheet-13733767.pdf?src-supplier=Ciiva; ComponentLink3URL: https://datasheet.octopart.com:443/LM75BIM-5%2B-Maxim-Integrated-datasheet-15933229.pdf?src-supplier=iiiC; ComponentLink3Description: https://datasheet.octopart.com:443/LM75BIM-5%2B-Maxim-Integrated-datasheet-15933229.pdf?src-supplier=iiiC; ComponentLink4URL: http://sigma.octopart.com:80/conflict_mineral_statement/Analog-Devices-company-33.pdf?src-supplier=Compliance+Statements; ComponentLink4Description: http://sigma.octopart.com:80/conflict_mineral_statement/Analog-Devices-company-33.pdf?src-supplier=Compliance+Statements; ComponentLink5URL: http://sigma.octopart.com:80/conflict_mineral_statement/Maxim-Integrated-company-65.pdf?src-supplier=Compliance+Statements; ComponentLink5Description: http://sigma.octopart.com:80/conflict_mineral_statement/Maxim-Integrated-company-65.pdf?src-supplier=Compliance+Statements; ComponentLink6URL: http://sigma.octopart.com:80/rohs_statement/Maxim-Integrated-company-66.pdf?src-supplier=Compliance+Statements; ComponentLink6Description: http://sigma.octopart.com:80/rohs_statement/Maxim-Integrated-company-66.pdf?src-supplier=Compliance+Statements; ComponentLink7URL: http://sigma.octopart.com:80/reach_statement/Maxim-Integrated-company-67.pdf?src-supplier=Compliance+Statements; ComponentLink7Description: http://sigma.octopart.com:80/reach_statement/Maxim-Integrated-company-67.pdf?src-supplier=Compliance+Statements; ComponentLink8URL: https://octopart.com:443/opatz8j6/c1?t=ANtBRCTaBdtvFyyuZNnEn44Ck4f0UNpo50vn_fQhfGrZ59IDdhfu2ipHRvQpLfcdo1pyCKCFJPWk8CxqPV5Go2Xy1MfrovsCR3DXvT7Gfy6JiDcwYz5R0lqVBT-d2HzchyXqrl0saZY6dsynHRKtZ8QolJYoY7wiWroMt77lbe_02i5Y6VAS4-QMQDFKJbGEtMk7trPgfBWZ1D3DU1KUo3jjNBd1KbG_03mihrdCH2VC6x6bVQtR-W63Ky_GYcKqaIEub4rG6TBSiLYzydBblAOC-QtCYgUJ-e1WKK81SMDSa7kogVs_&src-supplier=Compliance+Statements; ComponentLink8Description: https://octopart.com:443/opatz8j6/c1?t=ANtBRCTaBdtvFyyuZNnEn44Ck4f0UNpo50vn_fQhfGrZ59IDdhfu2ipHRvQpLfcdo1pyCKCFJPWk8CxqPV5Go2Xy1MfrovsCR3DXvT7Gfy6JiDcwYz5R0lqVBT-d2HzchyXqrl0saZY6dsynHRKtZ8QolJYoY7wiWroMt77lbe_02i5Y6VAS4-QMQDFKJbGEtMk7trPgfBWZ1D3DU1KUo3jjNBd1KbG_03mihrdCH2VC6x6bVQtR-W63Ky_GYcKqaIEub4rG6TBSiLYzydBblAOC-QtCYgUJ-e1WKK81SMDSa7kogVs_&src-supplier=Compliance+Statements
J1 J3 J4 = HEADER; 4PIN; 2.54; VER; TSW-104-14-L-S: Conn Unshrouded Header HDR 4 POS 2.54mm Solder ST Thru-Hole Automotive Bulk; Manufacturer: Samtec; Designer: TVBac; Supplier: Digikey; Supplier Part Number: SAM1055-04-ND; Manufacturer Part Number: TSW-104-14-L-S; RoHS: Yes; Category: Connectors; Stock: 1246; Pricing: 1=0.43, 10=0.377, 100=0.3107, 500=0.2702, 1000=0.22291, 5000=0.19589, 10000=0.18238 (USD); ComponentLink1URL: https://datasheet.ciiva.com/25618/0900766b81154476-25618487.pdf?src-supplier=Rs; ComponentLink1Description: https://datasheet.ciiva.com/25618/0900766b81154476-25618487.pdf?src-supplier=Rs; ComponentLink2URL: https://datasheet.ciiva.com/10190/htsw-th-10190703.pdf?src-supplier=Avnet; ComponentLink2Description: https://datasheet.ciiva.com/10190/htsw-th-10190703.pdf?src-supplier=Avnet; ComponentLink3Description: Link Digikey; ComponentLink3URL: https://www.digikey.com/en/products/detail/samtec-inc/TSW-104-14-L-S/1102620
J2 = Type-C; USB; HOR; RECEPTACLE;  24PIN; 217179-0001: USB Connector, 16 Contact(s), Female, Right Angle, Surface Mount Terminal, Locking, Receptacle; Manufacturer: Molex; USB Standard: USB 2.0; Current Rating: 1.25A; Number of Contacts: 16; Voltage Rating: 30V; Designer: TVBac; Supplier: Avnet; Supplier Part Number: 35AJ1973; Manufacturer Part Number: 217179-0001; RoHS: No; Category: Connectors; Stock: 7200; Pricing: 1=1.02, 25=0.853, 100=0.722, 250=0.677, 500=0.631 (USD); Contact Material: Nickel,Gold; Min Operating Temperature: -40°C; Max Operating Temperature: 85°C; Gender: Receptacle; Height: 3.36mm; ComponentLink1Description: Link Digikey; ComponentLink1URL: https://www.digikey.com/en/products/detail/molex/2171790001/13913749
L1 L2 = IND; 2.2uH; SMD; 6.3A; ETQ-P3M2R2KVP: Ind Power Shielded Wirewound 2.2uH 20% 100KHz Metal 6.3A (5.5 X 5 X 3mm) Emboss T/R; Manufacturer: Panasonic; Core Material: Metal,Composite; RMS Current (Irms): 5.2A; Saturation Current: 10.1A; DC Resistance (DCR): 22mR; Designer: TVBac; Supplier: Digikey; Supplier Part Number: P19759CT-ND; Manufacturer Part Number: ETQ-P3M2R2KVP; RoHS: Yes; Category: Fixed Inductors; Stock: 6203; Pricing: 1=0.89, 10=0.752, 25=0.6836, 50=0.6426, 100=0.5333, 250=0.49224, 500=0.4649, 1000=0.42387 (USD); Mounting Technology: Surface Mount; Case/Package: SMD/SMT; Min Operating Temperature: -55°C; Max Operating Temperature: 155°C; Packaging: Cut Tape; Inductance Tolerance: 20%; Series: PCC-M0530M; Tolerance: 20%; Shielding: Shielded; Test Frequency: 100kHz; Ratings: AEC-Q200; RoHS Compliant: Yes; Reach SVHC Compliant: Unknown; ComponentLink1URL: http://www.farnell.com/datasheets/2820815.pdf?src-supplier=Farnell; ComponentLink1Description: http://www.farnell.com/datasheets/2820815.pdf?src-supplier=Farnell; ComponentLink2URL: https://industrial.panasonic.com/cdbs/www-data/pdf/AGL0000/AGL0000C63.pdf?src-supplier=Digikey; ComponentLink2Description: https://industrial.panasonic.com/cdbs/www-data/pdf/AGL0000/AGL0000C63.pdf?src-supplier=Digikey; ComponentLink3URL: http://www.farnell.com/datasheets/2820815.pdf?src-supplier=Newark; ComponentLink3Description: http://www.farnell.com/datasheets/2820815.pdf?src-supplier=Newark; ComponentLink4URL: https://datasheet.octopart.com/ETQP3M2R2KVP-Panasonic-datasheet-98950113.pdf?src-supplier=Newark; ComponentLink4Description: https://datasheet.octopart.com/ETQP3M2R2KVP-Panasonic-datasheet-98950113.pdf?src-supplier=Newark; ComponentLink5URL: http://www.farnell.com/datasheets/2144948.pdf?src-supplier=Element14; ComponentLink5Description: http://www.farnell.com/datasheets/2144948.pdf?src-supplier=Element14; ComponentLink6URL: https://datasheet.octopart.com/ETQP3M2R2KVP-Panasonic-datasheet-65850535.pdf?src-supplier=Future+Electronics; ComponentLink6Description: https://datasheet.octopart.com/ETQP3M2R2KVP-Panasonic-datasheet-65850535.pdf?src-supplier=Future+Electronics; ComponentLink7URL: https://datasheet.octopart.com/ETQP3M2R2KVP-Panasonic-datasheet-137675050.pdf?src-supplier=TME; ComponentLink7Description: https://datasheet.octopart.com/ETQP3M2R2KVP-Panasonic-datasheet-137675050.pdf?src-supplier=TME; ComponentLink8Description: Link Digikey; ComponentLink8URL: https://www.digikey.com/en/products/detail/panasonic-electronic-components/ETQ-P3M2R2KVP/6134777
LCD1 = LCD; ST7735; 0.96Inch;
M1 = ESP32-S3-WROOM-1-N16R8; SMD;: SMD mod, ESP32-S3R8 with 3.3V, 8MB Octal PSRAM die insid, 6MBQuad SPI flash, pcb ant; Manufacturer: Espressif Systems; Designer: TVBac; Supplier: Digikey; Supplier Part Number: 1965-ESP32-S3-WROOM-1-N16R8CT-ND; Manufacturer Part Number: ESP32-S3-WROOM-1-N16R8; RoHS: No; Category: LDO; Stock: 8003; Pricing: 1=3.9 (USD); ComponentLink1Description: Link Digikey; ComponentLink1URL: https://www.digikey.com/en/products/detail/espressif-systems/ESP32-S3-WROOM-1-N16R8/16162642
Q1 = SMD; AO3400A; MOSFET; N-CH;: Trans MOSFET N-CH 30V 5.7A 3-Pin SOT-23; Manufacturer: Alpha & Omega Semiconductor; Rds On Max: 26.5mR; Input Capacitance: 630pF; Drain to Source Resistance: 18mR; Number of Channels: 1; Threshold Voltage: 650mV; Turn-Off Delay Time: 25ns; Turn-On Delay Time: 3ns; Supplier: Digikey; Supplier Part Number: 785-1000-1-ND; Manufacturer Part Number: AO3400A; RoHS: Yes; Category: MOSFETs; Stock: 457949; Pricing: 1=0.46, 10=0.282, 100=0.1787, 500=0.1337, 1000=0.11915 (USD); Mounting Technology: Surface Mount; Case/Package: TO-236-3; Min Operating Temperature: -55°C; Max Operating Temperature: 150°C; Packaging: Cut Tape; Drain to Source Voltage (Vdss): 30V; Continuous Drain Current (ID): 5.7A; Max Power Dissipation: 1.4W; Series: -; Drain to Source Breakdown Voltage: 30V; Height: 1.25mm; Lead Free: Lead Free; RoHS Compliant: Yes; ComponentLink1URL: https://datasheet.ciiva.com/940/ao3400a-940739.pdf?src-supplier=Digikey; ComponentLink1Description: https://datasheet.ciiva.com/940/ao3400a-940739.pdf?src-supplier=Digikey; ComponentLink2URL: https://datasheet.ciiva.com/26906/getdatasheetpartid-64438-26906526.pdf?src-supplier=Verical; ComponentLink2Description: https://datasheet.ciiva.com/26906/getdatasheetpartid-64438-26906526.pdf?src-supplier=Verical; ComponentLink3URL: https://datasheet.ciiva.com/940/ao3400a-940740.pdf?src-supplier=Digikey; ComponentLink3Description: https://datasheet.ciiva.com/940/ao3400a-940740.pdf?src-supplier=Digikey; ComponentLink4URL: https://datasheet.ciiva.com/940/ao3400a-940741.pdf?src-supplier=Digikey; ComponentLink4Description: https://datasheet.ciiva.com/940/ao3400a-940741.pdf?src-supplier=Digikey; Package: SOT23-3; Value: 5.7A
Q3 = SMD; AOD442; MOSFET; N-CH;: Trans MOSFET N-CH 60V 37A 3-Pin(2+Tab) DPAK; Manufacturer: Alpha & Omega Semiconductor; Manufacturer Part Number: AOD442; Designer: TVBac; Supplier: Digikey; Supplier Part Number: 785-1107-1-ND; RoHS: Yes; Category: MOSFETs; Stock: 335544; Pricing: 1=0.52, 10=0.448, 100=0.3099, 500=0.25896, 1000=0.2425 (USD); ComponentLink1URL: https://datasheet.ciiva.com/6384/aod442-6384657.pdf?src-supplier=Digikey; ComponentLink1Description: https://datasheet.ciiva.com/6384/aod442-6384657.pdf?src-supplier=Digikey; ComponentLink2URL: https://datasheet.ciiva.com/6384/aod442-6384654.pdf?src-supplier=Digikey; ComponentLink2Description: https://datasheet.ciiva.com/6384/aod442-6384654.pdf?src-supplier=Digikey; ComponentLink3URL: https://datasheet.ciiva.com/6384/aod442-6384651.pdf?src-supplier=Digikey; ComponentLink3Description: https://datasheet.ciiva.com/6384/aod442-6384651.pdf?src-supplier=Digikey; ComponentLink4Description: Link Digikey; ComponentLink4URL: https://www.digikey.kr/en/products/detail/alpha-omega-semiconductor-inc/AOD442/1855879
R1 R2 R5 R19 R28 = RES; 10K; 0603; SMD; RC0603FR-0710KL: SMD Chip Resistor, 10 Kohm, ½ 1%, 100 Mw, 0603 [1608 Metric], Thick Film, General Purpose; Manufacturer: Yageo; Voltage Rating (DC): 50V; Temperature Coefficient: 100ppm/°C; Voltage Rating: 75V; Power Rating: 100mW; Supplier: Future Electronics; Supplier Part Number: 4023214; Manufacturer Part Number: RC0603FR-0710KL; RoHS: Yes; Category: Chip SMD Resistors; Stock: 60200000; Pricing: 5000=0.0019, 20000=0.0018, 25000=0.0012, 50000=0.0018, 125000=0.0017, 200000=0.0016, 250000=0.0011, 750000=0.001 (USD); Case/Package: 0603; Pins: 2; Case Code (Imperial): 0603; Case Code (Metric): 1608; Weight: 7.1E-05oz; Min Operating Temperature: -55°C; Max Operating Temperature: 155°C; Tolerance: 1%; Packaging: Tape and Reel; Termination: SMD/SMT; Resistor Type: Thick Film; Features: Moisture Resistant; Series: RC; Max Power Dissipation: 100mW; Number of Terminations: 2; Resistance Tolerance: 1%; Construction: Rectangular; Length: 1.6mm; Width: 0.8mm; Height: 0.45mm; Depth: 0.8mm; Lead Pitch: 0.3mm; Reach SVHC Compliant: No; Lead Free: 5697LeadFree; Military Standard: Not; RoHS Compliant: Yes
R3 = RES; 0.1R; 1206; SMD; RL1206JR-070R1L: SMD Chip Resistor, 100 MOhm, ± 5%, 250 mW, 1206 [3216 Metric], Thick Film, Low Ohmic; Manufacturer: Yageo; Supplier: Future Electronics; Supplier Part Number: 1607514; Manufacturer Part Number: RL1206JR-070R1L; RoHS: Yes; Category: Chip SMD Resistors; Stock: 195000; Pricing: 5000=0.0122, 10000=0.012, 15000=0.0119, 25000=0.0117, 50000=0.0114 (USD); ComponentLink1URL: https://datasheet.ciiva.com/8083/pyu-rl-521-rohs-l-5-8083925.pdf?src-supplier=Avnet; ComponentLink1Description: https://datasheet.ciiva.com/8083/pyu-rl-521-rohs-l-5-8083925.pdf?src-supplier=Avnet; ComponentLink2URL: https://datasheet.ciiva.com/5558/pyu-rl-hp-521-rohs-l-2-5558220.pdf?src-supplier=Mouser; ComponentLink2Description: https://datasheet.ciiva.com/5558/pyu-rl-hp-521-rohs-l-2-5558220.pdf?src-supplier=Mouser
R4 R13 R15 R21 = RES; 5.1K; 0603; SMD; RMCF0603FT5K10: Res Thick Film 0603 5.1K Ohm 1% 0.1W(1/10W) ±100ppm/C Pad SMD T/R Automotive AEC-Q200; Manufacturer: Stackpole Electronics; Max Power Dissipation: 100mW; Temperature Coefficient: 100ppm/°C; Voltage Rating: 75V; Supplier: Digikey; Supplier Part Number: RMCF0603FT5K10CT-ND; Manufacturer Part Number: RMCF0603FT5K10; RoHS: Yes; Category: Chip SMD Resistors; Stock: 751079; Pricing: 1=0.1, 10=0.02, 100=0.0091, 1000=0.0048, 2500=0.00386 (USD); Mounting Technology: Surface Mount; Case/Package: 0603; Case Code (Metric): 1608; Case Code (Imperial): 0603; Contact Plating: Tin,Matte; Min Operating Temperature: -55°C; Max Operating Temperature: 155°C; Tolerance: 1%; Packaging: Tape and Reel; Number of Terminations: 2; Features: Automotive AEC-Q200; Series: RMCF; Length: 0.061inch; Width: 0.031inch; Height: 0.022inch; Radiation Hardening: No; RoHS Compliant: Yes; ComponentLink1URL: http://components.arrow.com/part/dataview/50863347S9465827N1174?src-supplier=Arrow+Electronics; ComponentLink1Description: http://components.arrow.com/part/dataview/50863347S9465827N1174?src-supplier=Arrow+Electronics; ComponentLink2URL: https://www.seielect.com/catalog/SEI-Packaging.pdf?src-supplier=Digikey; ComponentLink2Description: https://www.seielect.com/catalog/SEI-Packaging.pdf?src-supplier=Digikey; ComponentLink3URL: https://www.seielect.com/catalog/SEI-RMCF_RMCP.pdf?src-supplier=Avnet; ComponentLink3Description: https://www.seielect.com/catalog/SEI-RMCF_RMCP.pdf?src-supplier=Avnet
R6 R7 R10 R14 = RES; 1K; 0603; SMD; ESR03EZPF1001: SMD Chip Resistor, 1 kOhm, ± 1%, 250 mW, 0603 [1608 Metric], Thick Film, Anti-Surge; Manufacturer: Rohm; Voltage Rating: 150V; Designer: TVBac; Supplier: Digikey; Supplier Part Number: RHM1.00KADCT-ND; Manufacturer Part Number: ESR03EZPF1001; RoHS: Yes; Category: Chip SMD Resistors; Stock: 2703233; Pricing: 1=0.11, 10=0.055, 50=0.0364, 100=0.0309, 500=0.02206, 1000=0.01943 (USD); Voltage Rating (DC): 150V; Lead Free: 5697LeadFree; ComponentLink1URL: https://datasheet.ciiva.com/2469/esr-2469712.pdf?src-supplier=Digikey; ComponentLink1Description: https://datasheet.ciiva.com/2469/esr-2469712.pdf?src-supplier=Digikey; ComponentLink2URL: https://datasheet.ciiva.com/2469/esr-2469713.pdf?src-supplier=Digikey; ComponentLink2Description: https://datasheet.ciiva.com/2469/esr-2469713.pdf?src-supplier=Digikey; ComponentLink3URL: https://datasheet.ciiva.com/2469/esr-2469714.pdf?src-supplier=Digikey; ComponentLink3Description: https://datasheet.ciiva.com/2469/esr-2469714.pdf?src-supplier=Digikey; ComponentLink4Description: Link Digikey; ComponentLink4URL: https://www.digikey.com/en/products/detail/rohm-semiconductor/ESR03EZPF1001/1983428
R8 R9 R11 = RES; 0.5R; 0603; SMD; UCR03EVPFLR510: Res Thick Film 0603 0.51 Ohm 1% 0.2W(1/5W) 0ppm/C to 150ppm/C Pad SMD T/R Automotive AEC-Q200; Manufacturer: Rohm; Temperature Coefficient: 150ppm/°C; Max Power Dissipation: 200mW; Designer: TVBac; Supplier: Mouser; Supplier Part Number: 755-UCR03EVPFLR510; Manufacturer Part Number: UCR03EVPFLR510; RoHS: Yes; Category: Chip SMD Resistors; Stock: 9265; Pricing: 1=0.63, 10=0.319, 50=0.319, 100=0.229, 1000=0.153, 10000=0.136 (USD); Case/Package: 0603; Case Code (Metric): 1608; Case Code (Imperial): 0603; Min Operating Temperature: -55°C; Max Operating Temperature: 155°C; Packaging: Cut Tape; Tolerance: 1%; Number of Terminations: 2; Features: Automotive AEC-Q200; Series: UCR; Ratings: AEC-Q200; Lead Free: Lead Free; RoHS Compliant: Yes; ComponentLink1URL: https://datasheet.ciiva.com/14926/ucr-14926334.pdf?src-supplier=Digikey; ComponentLink1Description: https://datasheet.ciiva.com/14926/ucr-14926334.pdf?src-supplier=Digikey; ComponentLink2URL: https://datasheet.ciiva.com/14927/ucr-14927064.pdf?src-supplier=Digikey; ComponentLink2Description: https://datasheet.ciiva.com/14927/ucr-14927064.pdf?src-supplier=Digikey; ComponentLink3Description: Link Digikey; ComponentLink3URL: https://www.digikey.com/en/products/detail/rohm-semiconductor/UCR03EVPFLR510/4053600